# EAGLE schematic Main board schematic (EAGLE 9.2.0)

## Sheet 1 of 2
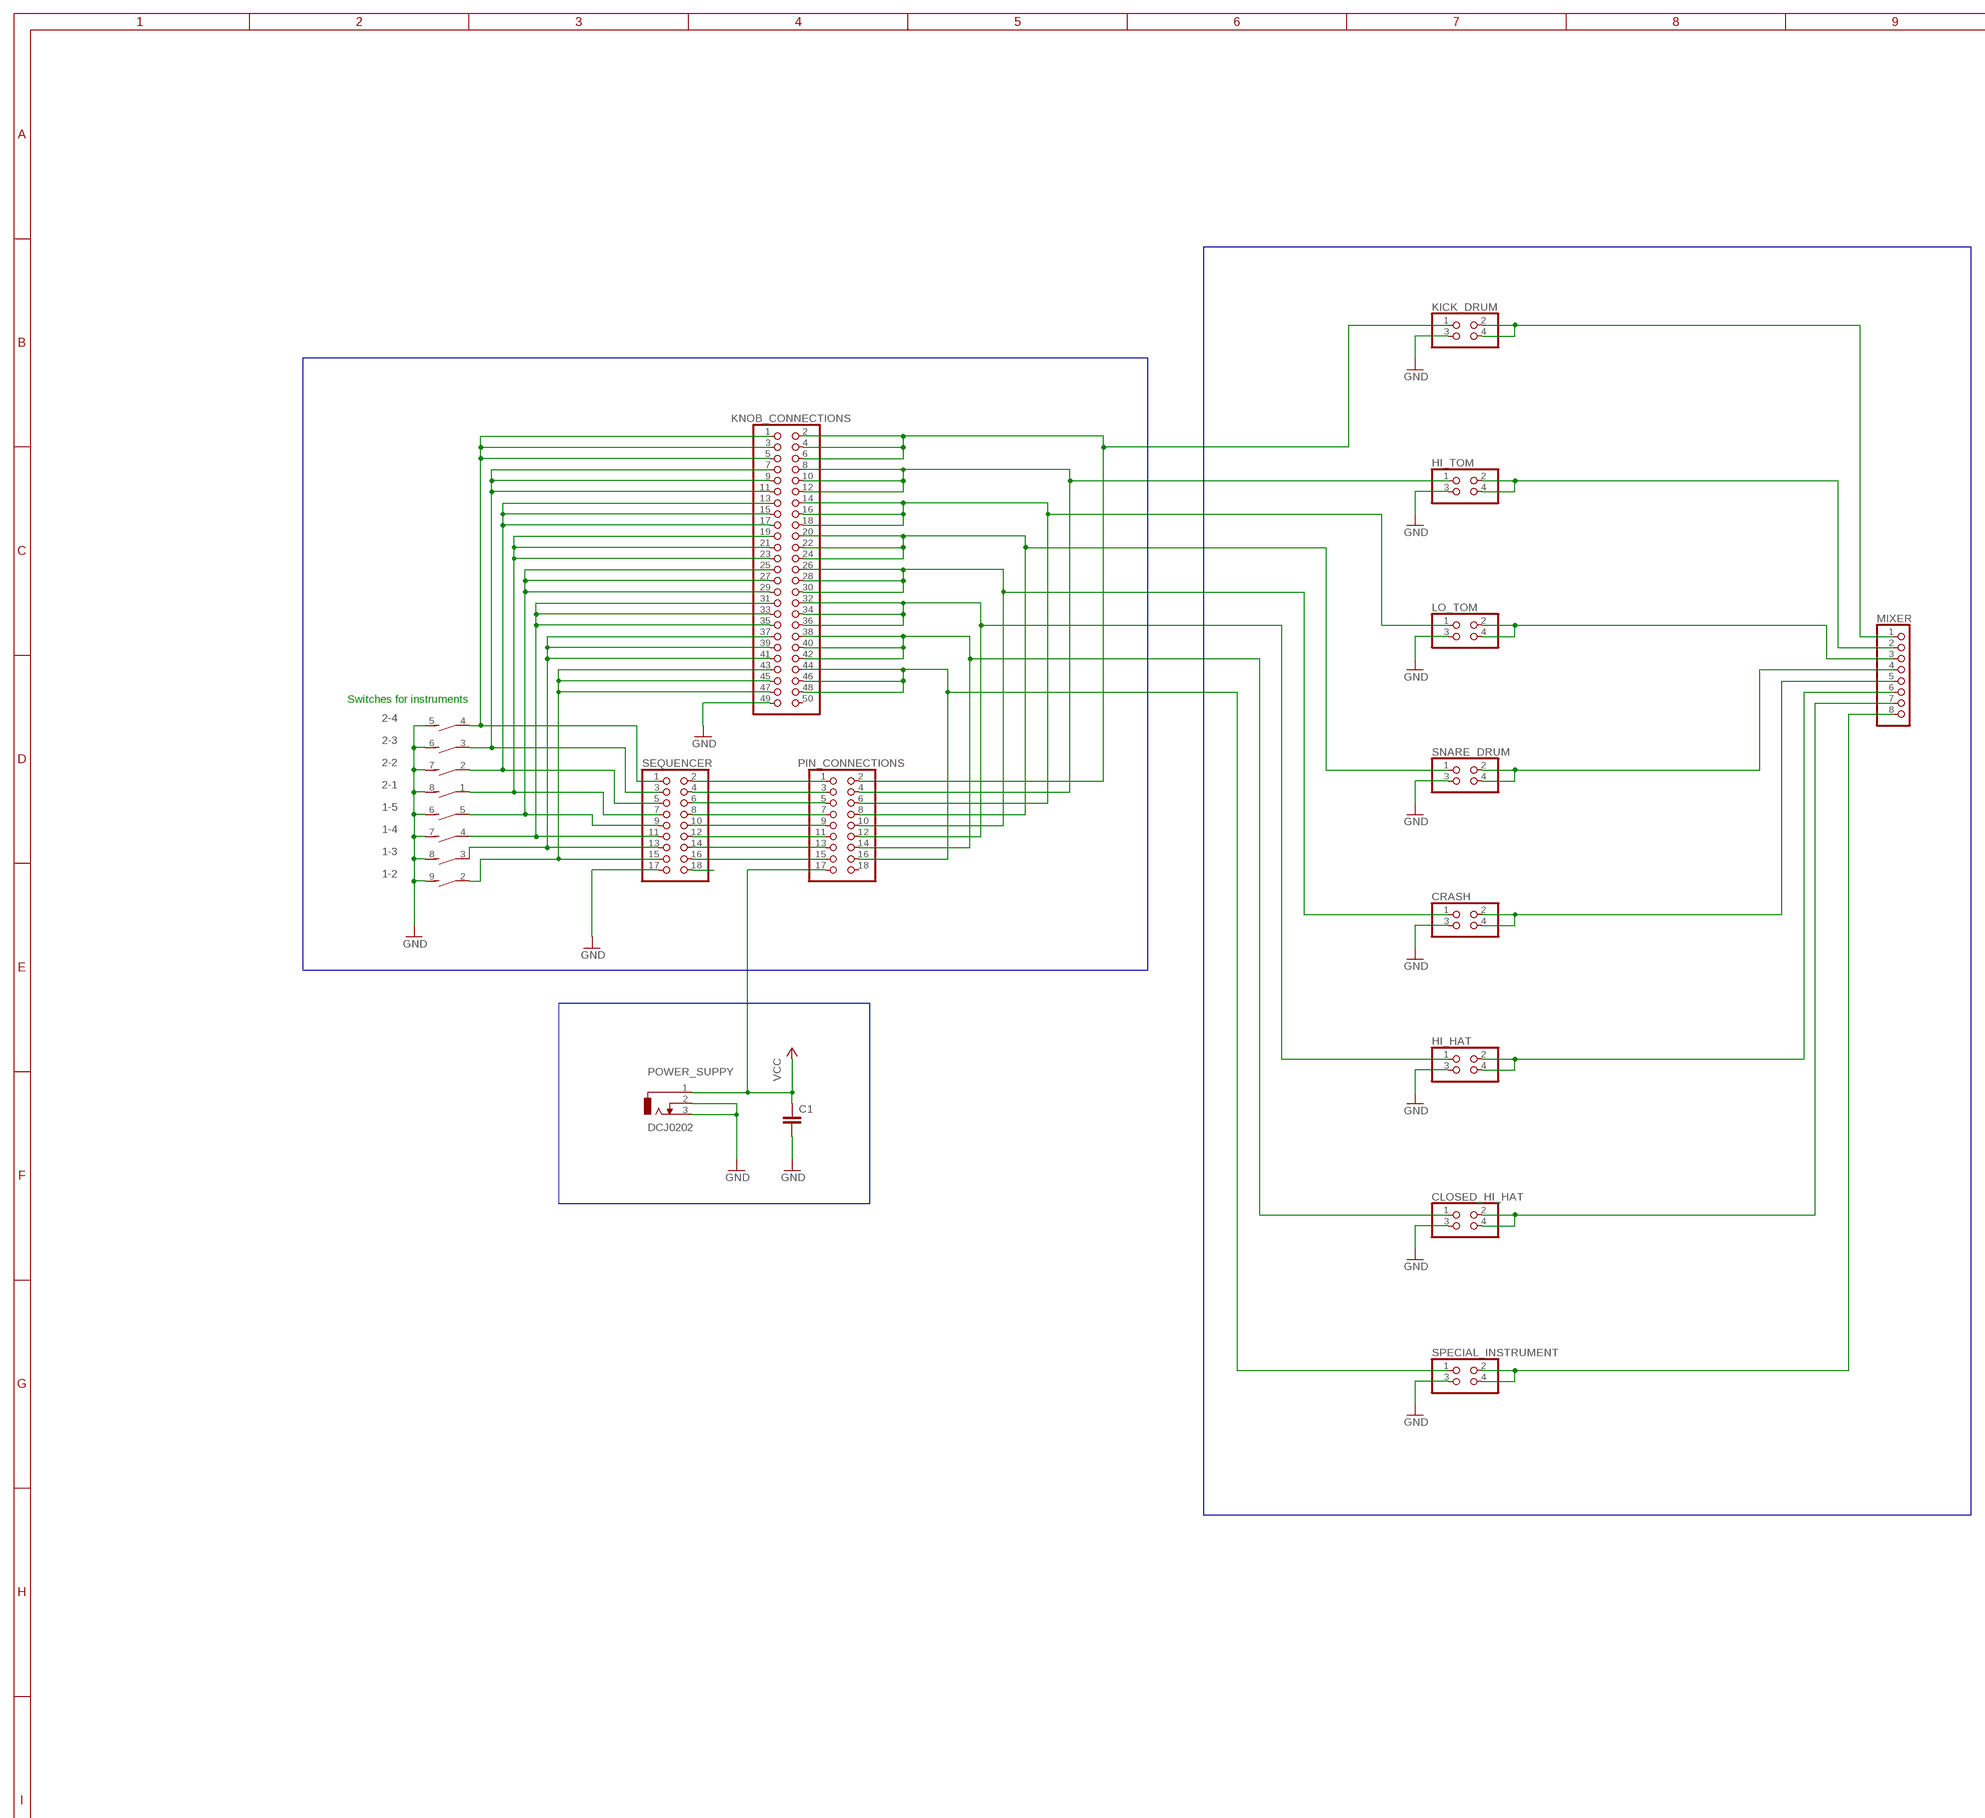
[diagram p0: schematic, sheet 1, part 1 of 2]
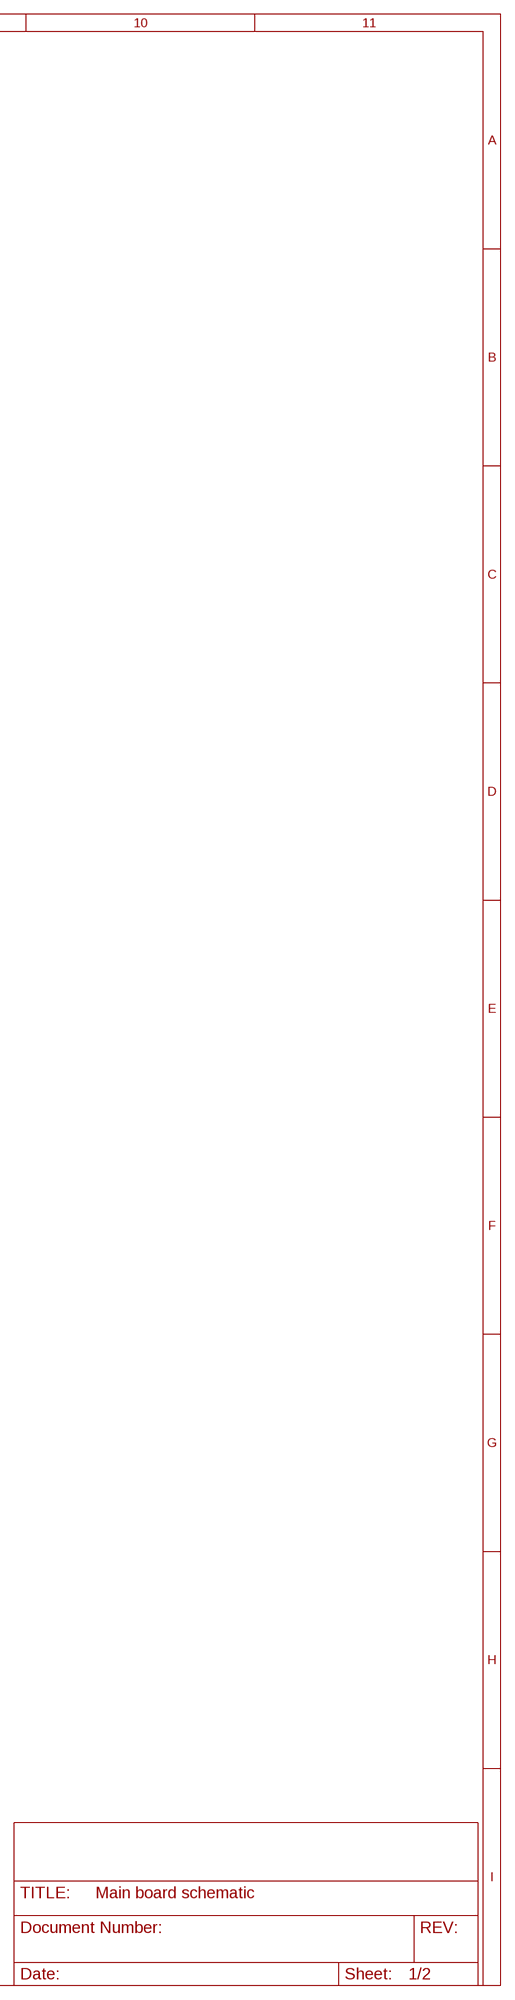
[diagram p1: schematic, sheet 1, part 2 of 2]

### Parts
1  DS05E  [DS-05]
2  DIP04S  [DIP04S]
C1  C2,5-3  [C2.5-3]
CLOSED_HI_HAT  PINHD-2X2  [2X02]
CRASH  PINHD-2X2  [2X02]
HI_HAT  PINHD-2X2  [2X02]
HI_TOM  PINHD-2X2  [2X02]
KICK_DRUM  PINHD-2X2  [2X02]
KNOB_CONNECTIONS  PINHD-2X25  [2X25]
LO_TOM  PINHD-2X2  [2X02]
MIXER  PINHD-1X8  [1X08]
PIN_CONNECTIONS  PINHD-2X9  [2X09]
POWER_SUPPY  DCJ0202  [DCJ0202]
SEQUENCER  PINHD-2X9  [2X09]
SNARE_DRUM  PINHD-2X2  [2X02]
SPECIAL_INSTRUMENT  PINHD-2X2  [2X02]

### Nets
GND: 1.6 1.7 1.8 1.9 2.5 2.6 2.7 2.8 C1.2 CLOSED_HI_HAT.3 CRASH.3 HI_HAT.3 HI_TOM.3 KICK_DRUM.3 KNOB_CONNECTIONS.49 LO_TOM.3 POWER_SUPPY.2 POWER_SUPPY.3 SEQUENCER.17 SNARE_DRUM.3 SPECIAL_INSTRUMENT.3 ; also sheet 2
N$1: 2.3 KNOB_CONNECTIONS.7 KNOB_CONNECTIONS.9 KNOB_CONNECTIONS.11 SEQUENCER.3
N$2: 2.1 KNOB_CONNECTIONS.19 KNOB_CONNECTIONS.21 KNOB_CONNECTIONS.23 SEQUENCER.7
N$3: 1.5 KNOB_CONNECTIONS.25 KNOB_CONNECTIONS.27 KNOB_CONNECTIONS.29 SEQUENCER.9
N$4: 1.4 KNOB_CONNECTIONS.31 KNOB_CONNECTIONS.33 KNOB_CONNECTIONS.35 SEQUENCER.11
N$5: 1.3 KNOB_CONNECTIONS.37 KNOB_CONNECTIONS.39 KNOB_CONNECTIONS.41 SEQUENCER.13
N$6: KNOB_CONNECTIONS.14 KNOB_CONNECTIONS.16 KNOB_CONNECTIONS.18 LO_TOM.1 PIN_CONNECTIONS.6
N$8: 2.4 KNOB_CONNECTIONS.1 KNOB_CONNECTIONS.3 KNOB_CONNECTIONS.5 SEQUENCER.1
N$9: PIN_CONNECTIONS.1 SEQUENCER.2
N$10: 1.2 KNOB_CONNECTIONS.43 KNOB_CONNECTIONS.45 KNOB_CONNECTIONS.47 SEQUENCER.15
N$11: PIN_CONNECTIONS.3 SEQUENCER.4
N$12: PIN_CONNECTIONS.5 SEQUENCER.6
N$13: KNOB_CONNECTIONS.20 KNOB_CONNECTIONS.22 KNOB_CONNECTIONS.24 PIN_CONNECTIONS.8 SNARE_DRUM.1
N$14: HI_TOM.1 KNOB_CONNECTIONS.8 KNOB_CONNECTIONS.10 KNOB_CONNECTIONS.12 PIN_CONNECTIONS.4
N$15: PIN_CONNECTIONS.7 SEQUENCER.8
N$16: PIN_CONNECTIONS.9 SEQUENCER.10
N$17: PIN_CONNECTIONS.11 SEQUENCER.12
N$18: PIN_CONNECTIONS.13 SEQUENCER.14
N$19: PIN_CONNECTIONS.15 SEQUENCER.16
N$22: 2.2 KNOB_CONNECTIONS.13 KNOB_CONNECTIONS.15 KNOB_CONNECTIONS.17 SEQUENCER.5
N$23: CRASH.1 KNOB_CONNECTIONS.26 KNOB_CONNECTIONS.28 KNOB_CONNECTIONS.30 PIN_CONNECTIONS.10
N$24: HI_HAT.1 KNOB_CONNECTIONS.32 KNOB_CONNECTIONS.34 KNOB_CONNECTIONS.36 PIN_CONNECTIONS.12
N$25: KICK_DRUM.1 KNOB_CONNECTIONS.2 KNOB_CONNECTIONS.4 KNOB_CONNECTIONS.6 PIN_CONNECTIONS.2
N$26: KICK_DRUM.2 KICK_DRUM.4 MIXER.1
N$27: HI_TOM.2 HI_TOM.4 MIXER.2
N$28: CLOSED_HI_HAT.1 KNOB_CONNECTIONS.38 KNOB_CONNECTIONS.40 KNOB_CONNECTIONS.42 PIN_CONNECTIONS.14
N$29: KNOB_CONNECTIONS.44 KNOB_CONNECTIONS.46 KNOB_CONNECTIONS.48 PIN_CONNECTIONS.16 SPECIAL_INSTRUMENT.1
N$30: LO_TOM.2 LO_TOM.4 MIXER.3
N$32: MIXER.4 SNARE_DRUM.2 SNARE_DRUM.4
N$33: CRASH.2 CRASH.4 MIXER.5
N$34: HI_HAT.2 HI_HAT.4 MIXER.6
N$35: CLOSED_HI_HAT.2 CLOSED_HI_HAT.4 MIXER.7
N$36: MIXER.8 SPECIAL_INSTRUMENT.2 SPECIAL_INSTRUMENT.4
VCC: C1.1 PIN_CONNECTIONS.17 POWER_SUPPY.1
X: SEQUENCER.18
Unconnected: 1.1 1.10 KNOB_CONNECTIONS.50 PIN_CONNECTIONS.18

### Buses
B$1
B$2
B$3

### Notes on the sheet
- Switches for instruments

## Sheet 2 of 2
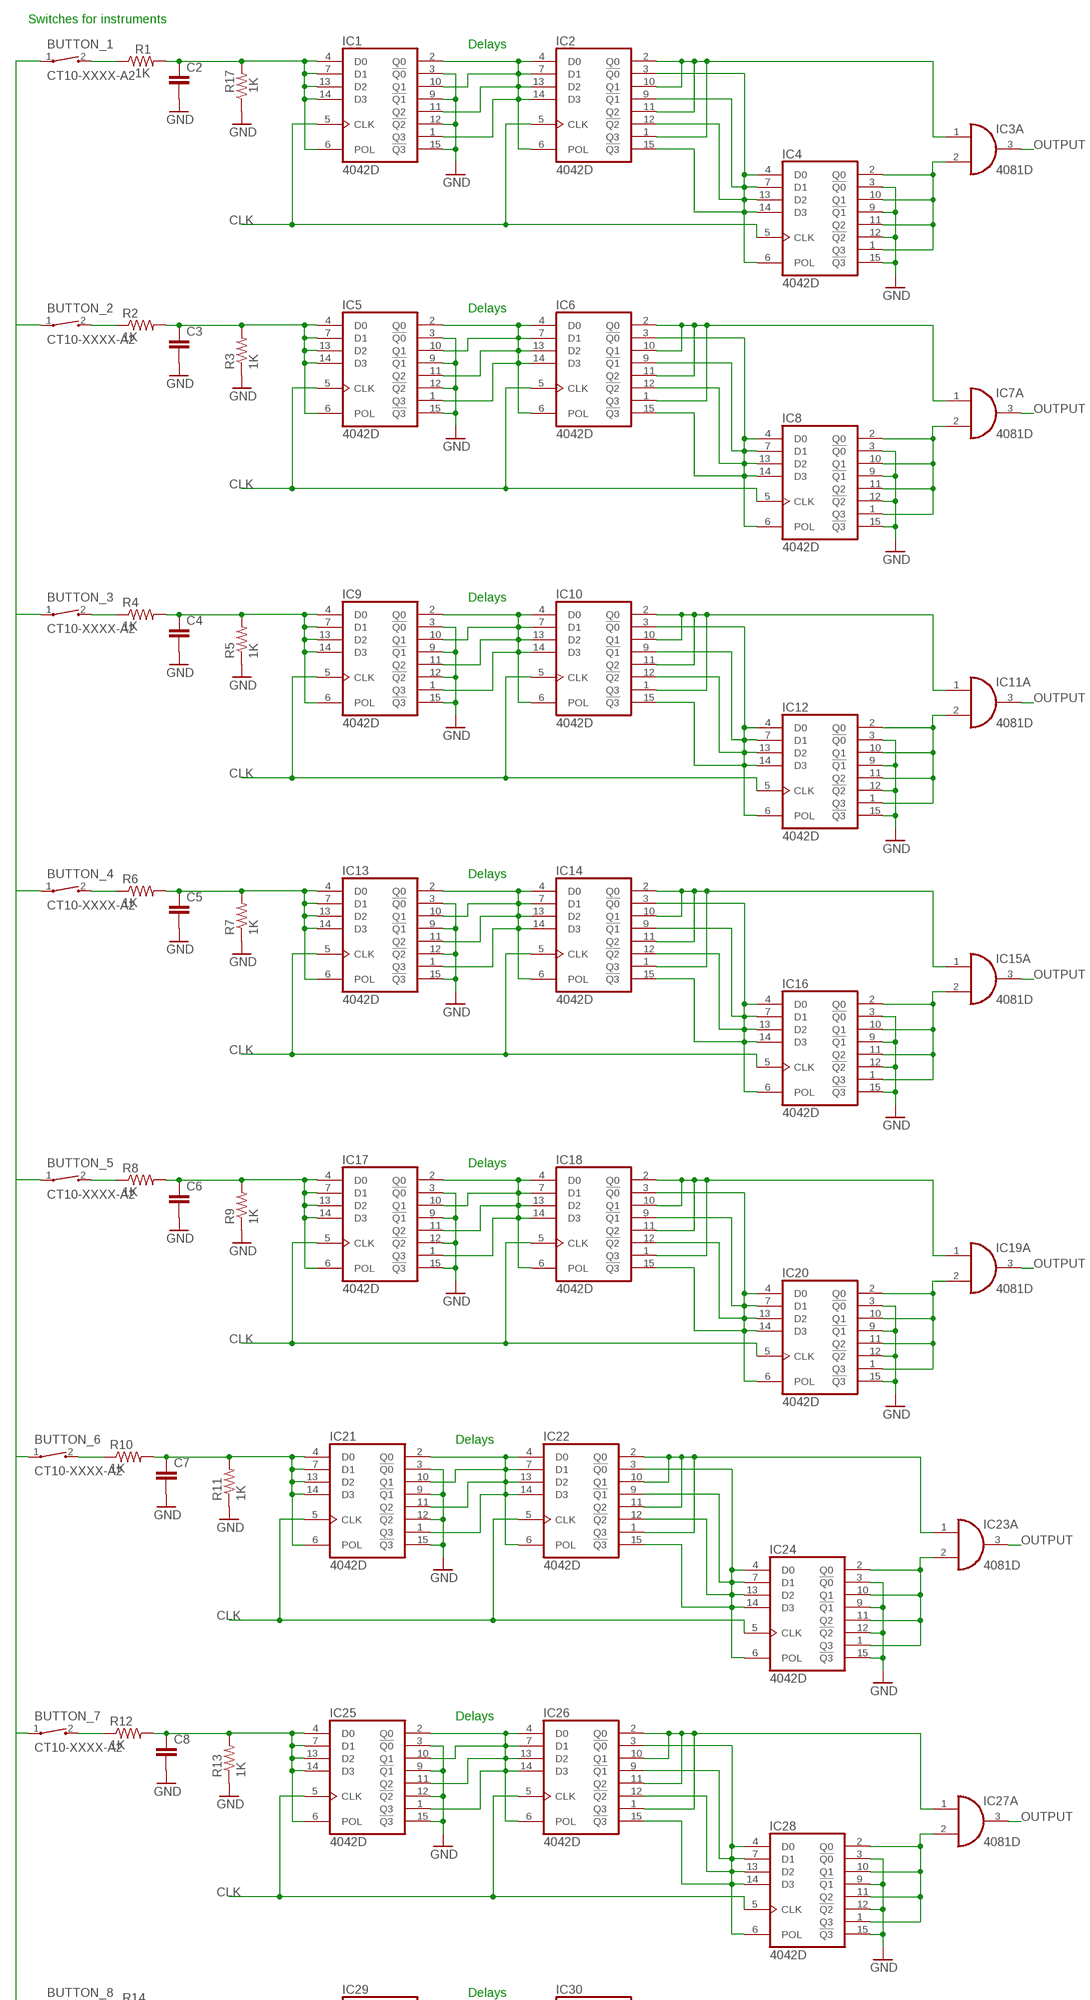
[diagram p2: schematic, sheet 2, part 1 of 3]
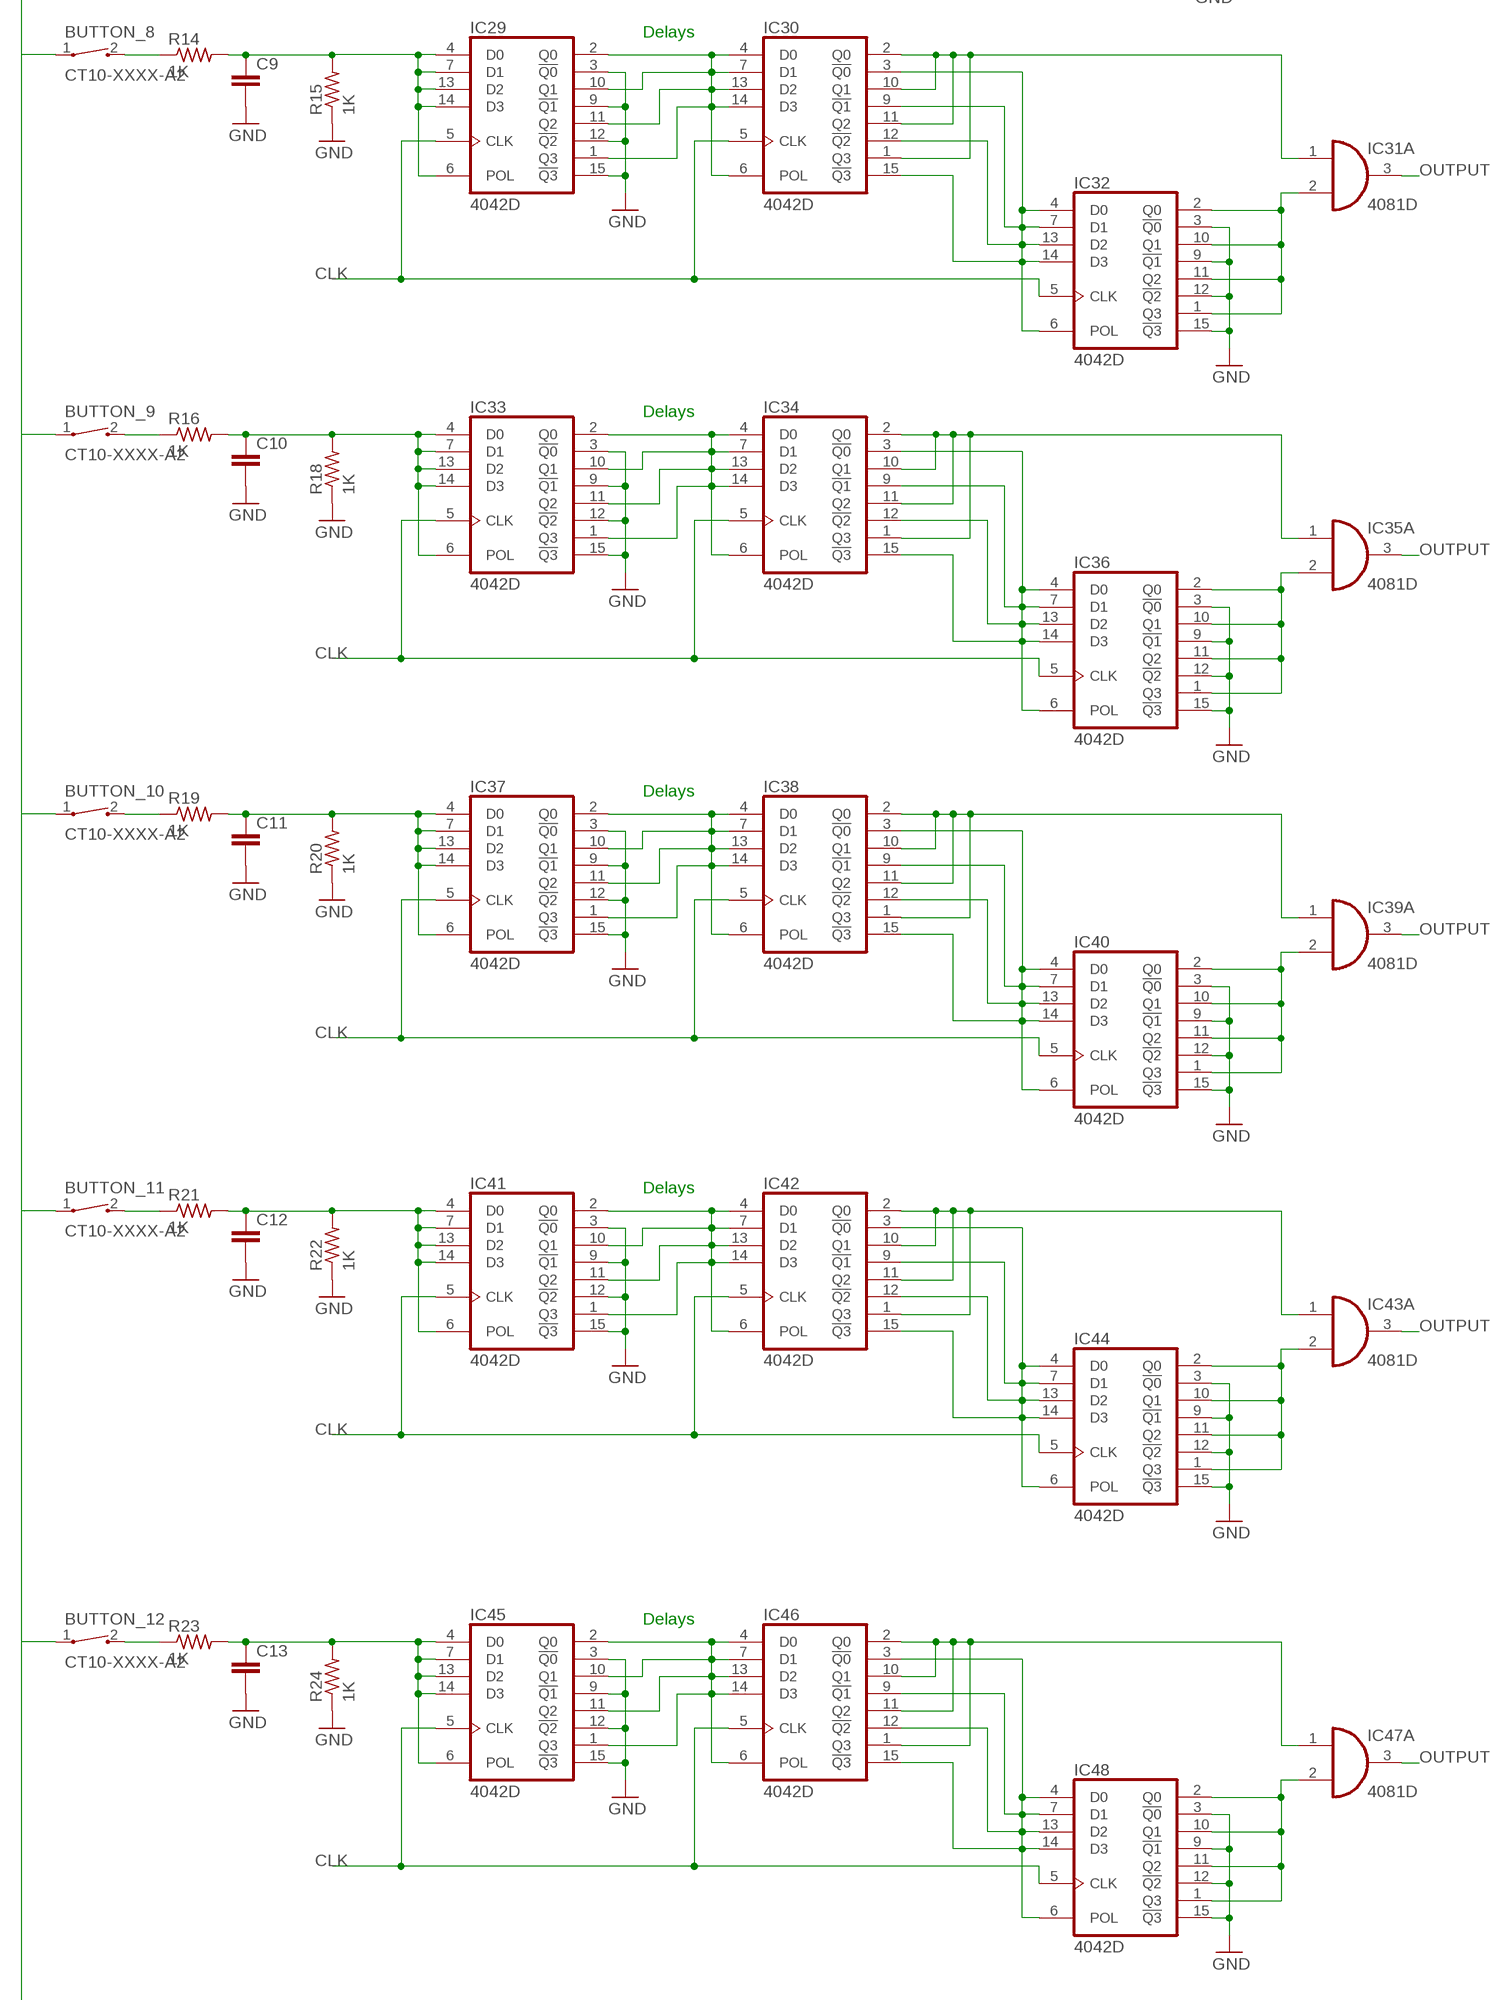
[diagram p3: schematic, sheet 2, part 2 of 3]
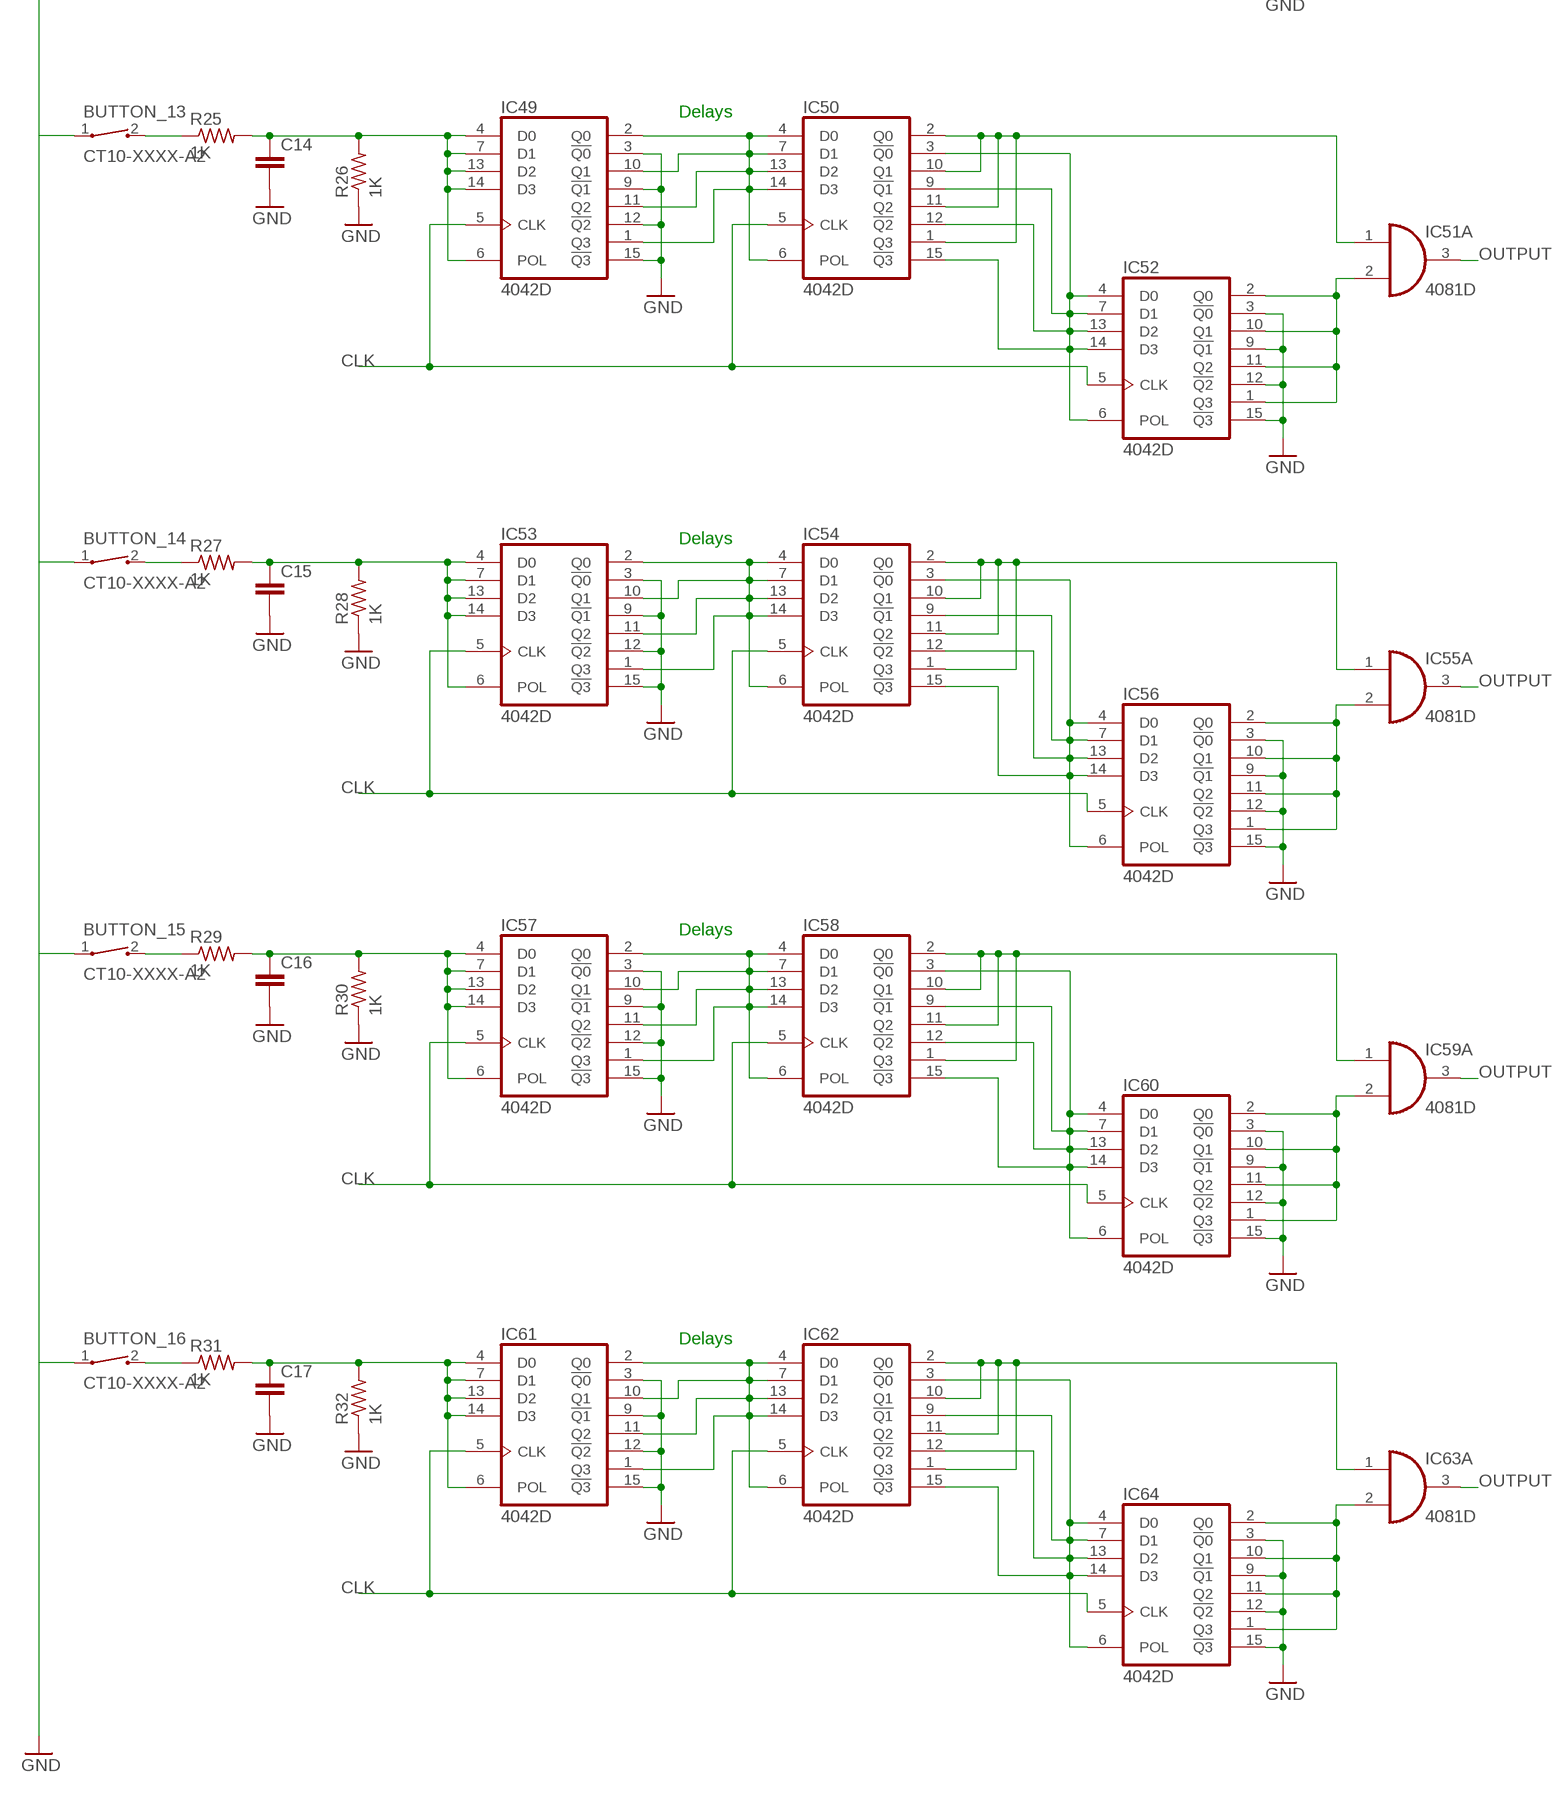
[diagram p4: schematic, sheet 2, part 3 of 3]

### Parts
BUTTON_1  CT10-XXXX-A2  [CT10-XXXX-A2]
BUTTON_2  CT10-XXXX-A2  [CT10-XXXX-A2]
BUTTON_3  CT10-XXXX-A2  [CT10-XXXX-A2]
BUTTON_4  CT10-XXXX-A2  [CT10-XXXX-A2]
BUTTON_5  CT10-XXXX-A2  [CT10-XXXX-A2]
BUTTON_6  CT10-XXXX-A2  [CT10-XXXX-A2]
BUTTON_7  CT10-XXXX-A2  [CT10-XXXX-A2]
BUTTON_8  CT10-XXXX-A2  [CT10-XXXX-A2]
BUTTON_9  CT10-XXXX-A2  [CT10-XXXX-A2]
BUTTON_10  CT10-XXXX-A2  [CT10-XXXX-A2]
BUTTON_11  CT10-XXXX-A2  [CT10-XXXX-A2]
BUTTON_12  CT10-XXXX-A2  [CT10-XXXX-A2]
BUTTON_13  CT10-XXXX-A2  [CT10-XXXX-A2]
BUTTON_14  CT10-XXXX-A2  [CT10-XXXX-A2]
BUTTON_15  CT10-XXXX-A2  [CT10-XXXX-A2]
BUTTON_16  CT10-XXXX-A2  [CT10-XXXX-A2]
C2  C5/3  [C5B3]
C3  C5/3  [C5B3]
C4  C5/3  [C5B3]
C5  C5/3  [C5B3]
C6  C5/3  [C5B3]
C7  C5/3  [C5B3]
C8  C5/3  [C5B3]
C9  C5/3  [C5B3]
C10  C5/3  [C5B3]
C11  C5/3  [C5B3]
C12  C5/3  [C5B3]
C13  C5/3  [C5B3]
C14  C5/3  [C5B3]
C15  C5/3  [C5B3]
C16  C5/3  [C5B3]
C17  C5/3  [C5B3]
IC1  4042D  [SO16]
IC2  4042D  [SO16]
IC3  4081D  [SO14]
IC4  4042D  [SO16]
IC5  4042D  [SO16]
IC6  4042D  [SO16]
IC7  4081D  [SO14]
IC8  4042D  [SO16]
IC9  4042D  [SO16]
IC10  4042D  [SO16]
IC11  4081D  [SO14]
IC12  4042D  [SO16]
IC13  4042D  [SO16]
IC14  4042D  [SO16]
IC15  4081D  [SO14]
IC16  4042D  [SO16]
IC17  4042D  [SO16]
IC18  4042D  [SO16]
IC19  4081D  [SO14]
IC20  4042D  [SO16]
IC21  4042D  [SO16]
IC22  4042D  [SO16]
IC23  4081D  [SO14]
IC24  4042D  [SO16]
IC25  4042D  [SO16]
IC26  4042D  [SO16]
IC27  4081D  [SO14]
IC28  4042D  [SO16]
IC29  4042D  [SO16]
IC30  4042D  [SO16]
IC31  4081D  [SO14]
IC32  4042D  [SO16]
IC33  4042D  [SO16]
IC34  4042D  [SO16]
IC35  4081D  [SO14]
IC36  4042D  [SO16]
IC37  4042D  [SO16]
IC38  4042D  [SO16]
IC39  4081D  [SO14]
IC40  4042D  [SO16]
IC41  4042D  [SO16]
IC42  4042D  [SO16]
IC43  4081D  [SO14]
IC44  4042D  [SO16]
IC45  4042D  [SO16]
IC46  4042D  [SO16]
IC47  4081D  [SO14]
IC48  4042D  [SO16]
IC49  4042D  [SO16]
IC50  4042D  [SO16]
IC51  4081D  [SO14]
IC52  4042D  [SO16]
IC53  4042D  [SO16]
IC54  4042D  [SO16]
IC55  4081D  [SO14]
IC56  4042D  [SO16]
IC57  4042D  [SO16]
IC58  4042D  [SO16]
IC59  4081D  [SO14]
IC60  4042D  [SO16]
IC61  4042D  [SO16]
IC62  4042D  [SO16]
IC63  4081D  [SO14]
IC64  4042D  [SO16]
R1  1K  R-US_0204/7  [0204/7]
R2  1K  R-US_0204/7  [0204/7]
R3  1K  R-US_0204/7  [0204/7]
R4  1K  R-US_0204/7  [0204/7]
R5  1K  R-US_0204/7  [0204/7]
R6  1K  R-US_0204/7  [0204/7]
R7  1K  R-US_0204/7  [0204/7]
R8  1K  R-US_0204/7  [0204/7]
R9  1K  R-US_0204/7  [0204/7]
R10  1K  R-US_0204/7  [0204/7]
R11  1K  R-US_0204/7  [0204/7]
R12  1K  R-US_0204/7  [0204/7]
R13  1K  R-US_0204/7  [0204/7]
R14  1K  R-US_0204/7  [0204/7]
R15  1K  R-US_0204/7  [0204/7]
R16  1K  R-US_0204/7  [0204/7]
R17  1K  R-US_0204/7  [0204/7]
R18  1K  R-US_0204/7  [0204/7]
R19  1K  R-US_0204/7  [0204/7]
R20  1K  R-US_0204/7  [0204/7]
R21  1K  R-US_0204/7  [0204/7]
R22  1K  R-US_0204/7  [0204/7]
R23  1K  R-US_0204/7  [0204/7]
R24  1K  R-US_0204/7  [0204/7]
R25  1K  R-US_0204/7  [0204/7]
R26  1K  R-US_0204/7  [0204/7]
R27  1K  R-US_0204/7  [0204/7]
R28  1K  R-US_0204/7  [0204/7]
R29  1K  R-US_0204/7  [0204/7]
R30  1K  R-US_0204/7  [0204/7]
R31  1K  R-US_0204/7  [0204/7]
R32  1K  R-US_0204/7  [0204/7]

### Nets
CLK: IC1.5(CLK) IC2.5(CLK) IC4.5(CLK) IC5.5(CLK) IC6.5(CLK) IC8.5(CLK) IC9.5(CLK) IC10.5(CLK) IC12.5(CLK) IC13.5(CLK) IC14.5(CLK) IC16.5(CLK) IC17.5(CLK) IC18.5(CLK) IC20.5(CLK) IC21.5(CLK) IC22.5(CLK) IC24.5(CLK) IC25.5(CLK) IC26.5(CLK) IC28.5(CLK) IC29.5(CLK) IC30.5(CLK) IC32.5(CLK) IC33.5(CLK) IC34.5(CLK) IC36.5(CLK) IC37.5(CLK) IC38.5(CLK) IC40.5(CLK) IC41.5(CLK) IC42.5(CLK) IC44.5(CLK) IC45.5(CLK) IC46.5(CLK) IC48.5(CLK) IC49.5(CLK) IC50.5(CLK) IC52.5(CLK) IC53.5(CLK) IC54.5(CLK) IC56.5(CLK) IC57.5(CLK) IC58.5(CLK) IC60.5(CLK) IC61.5(CLK) IC62.5(CLK) IC64.5(CLK)
GND: BUTTON_1.1 C2.2 C3.2 C4.2 C5.2 C6.2 C7.2 C8.2 C9.2 C10.2 C11.2 C12.2 C13.2 C14.2 C15.2 C16.2 C17.2 IC1.3(!Q0) IC1.9(!Q1) IC1.12(!Q2) IC1.15(!Q3) IC4.3(!Q0) IC4.9(!Q1) IC4.12(!Q2) IC4.15(!Q3) IC5.3(!Q0) IC5.9(!Q1) IC5.12(!Q2) IC5.15(!Q3) IC8.3(!Q0) IC8.9(!Q1) IC8.12(!Q2) IC8.15(!Q3) IC9.3(!Q0) IC9.9(!Q1) IC9.12(!Q2) IC9.15(!Q3) IC12.3(!Q0) IC12.9(!Q1) IC12.12(!Q2) IC12.15(!Q3) IC13.3(!Q0) IC13.9(!Q1) IC13.12(!Q2) IC13.15(!Q3) IC16.3(!Q0) IC16.9(!Q1) IC16.12(!Q2) IC16.15(!Q3) IC17.3(!Q0) IC17.9(!Q1) IC17.12(!Q2) IC17.15(!Q3) IC20.3(!Q0) IC20.9(!Q1) IC20.12(!Q2) IC20.15(!Q3) IC21.3(!Q0) IC21.9(!Q1) IC21.12(!Q2) IC21.15(!Q3) IC24.3(!Q0) IC24.9(!Q1) IC24.12(!Q2) IC24.15(!Q3) IC25.3(!Q0) IC25.9(!Q1) IC25.12(!Q2) IC25.15(!Q3) IC28.3(!Q0) IC28.9(!Q1) IC28.12(!Q2) IC28.15(!Q3) IC29.3(!Q0) IC29.9(!Q1) IC29.12(!Q2) IC29.15(!Q3) IC32.3(!Q0) IC32.9(!Q1) IC32.12(!Q2) IC32.15(!Q3) IC33.3(!Q0) IC33.9(!Q1) IC33.12(!Q2) IC33.15(!Q3) IC36.3(!Q0) IC36.9(!Q1) IC36.12(!Q2) IC36.15(!Q3) IC37.3(!Q0) IC37.9(!Q1) IC37.12(!Q2) IC37.15(!Q3) IC40.3(!Q0) IC40.9(!Q1) IC40.12(!Q2) IC40.15(!Q3) IC41.3(!Q0) IC41.9(!Q1) IC41.12(!Q2) IC41.15(!Q3) IC44.3(!Q0) IC44.9(!Q1) IC44.12(!Q2) IC44.15(!Q3) IC45.3(!Q0) IC45.9(!Q1) IC45.12(!Q2) IC45.15(!Q3) IC48.3(!Q0) IC48.9(!Q1) IC48.12(!Q2) IC48.15(!Q3) IC49.3(!Q0) IC49.9(!Q1) IC49.12(!Q2) IC49.15(!Q3) IC52.3(!Q0) IC52.9(!Q1) IC52.12(!Q2) IC52.15(!Q3) IC53.3(!Q0) IC53.9(!Q1) IC53.12(!Q2) IC53.15(!Q3) IC56.3(!Q0) IC56.9(!Q1) IC56.12(!Q2) IC56.15(!Q3) IC57.3(!Q0) IC57.9(!Q1) IC57.12(!Q2) IC57.15(!Q3) IC60.3(!Q0) IC60.9(!Q1) IC60.12(!Q2) IC60.15(!Q3) IC61.3(!Q0) IC61.9(!Q1) IC61.12(!Q2) IC61.15(!Q3) IC64.3(!Q0) IC64.9(!Q1) IC64.12(!Q2) IC64.15(!Q3) R3.1 R5.1 R7.1 R9.1 R11.1 R13.1 R15.1 R17.1 R18.1 R20.1 R22.1 R24.1 R26.1 R28.1 R30.1 R32.1 ; also sheet 1
N$7: BUTTON_1.2 R1.1
N$20: BUTTON_2.2 R2.1
N$21: C3.1 IC5.4(D0) IC5.6(POL) IC5.7(D1) IC5.13(D2) IC5.14(D3) R2.2 R3.2
N$31: IC5.1(Q3) IC5.2(Q0) IC5.10(Q1) IC5.11(Q2) IC6.4(D0) IC6.6(POL) IC6.7(D1) IC6.13(D2) IC6.14(D3)
N$37: IC7.2(A:I1) IC8.1(Q3) IC8.2(Q0) IC8.10(Q1) IC8.11(Q2)
N$38: IC6.3(!Q0) IC6.9(!Q1) IC6.12(!Q2) IC6.15(!Q3) IC8.4(D0) IC8.6(POL) IC8.7(D1) IC8.13(D2) IC8.14(D3)
N$39: IC6.1(Q3) IC6.2(Q0) IC6.10(Q1) IC6.11(Q2) IC7.1(A:I0)
N$40: BUTTON_2.1
N$41: BUTTON_3.2 R4.1
N$42: C4.1 IC9.4(D0) IC9.6(POL) IC9.7(D1) IC9.13(D2) IC9.14(D3) R4.2 R5.2
N$43: IC9.1(Q3) IC9.2(Q0) IC9.10(Q1) IC9.11(Q2) IC10.4(D0) IC10.6(POL) IC10.7(D1) IC10.13(D2) IC10.14(D3)
N$44: IC11.2(A:I1) IC12.1(Q3) IC12.2(Q0) IC12.10(Q1) IC12.11(Q2)
N$45: IC10.3(!Q0) IC10.9(!Q1) IC10.12(!Q2) IC10.15(!Q3) IC12.4(D0) IC12.6(POL) IC12.7(D1) IC12.13(D2) IC12.14(D3)
N$46: IC10.1(Q3) IC10.2(Q0) IC10.10(Q1) IC10.11(Q2) IC11.1(A:I0)
N$47: BUTTON_3.1
N$48: BUTTON_4.2 R6.1
N$49: C2.1 IC1.4(D0) IC1.6(POL) IC1.7(D1) IC1.13(D2) IC1.14(D3) R1.2 R17.2
N$50: C5.1 IC13.4(D0) IC13.6(POL) IC13.7(D1) IC13.13(D2) IC13.14(D3) R6.2 R7.2
N$51: IC13.1(Q3) IC13.2(Q0) IC13.10(Q1) IC13.11(Q2) IC14.4(D0) IC14.6(POL) IC14.7(D1) IC14.13(D2) IC14.14(D3)
N$52: IC15.2(A:I1) IC16.1(Q3) IC16.2(Q0) IC16.10(Q1) IC16.11(Q2)
N$53: IC14.3(!Q0) IC14.9(!Q1) IC14.12(!Q2) IC14.15(!Q3) IC16.4(D0) IC16.6(POL) IC16.7(D1) IC16.13(D2) IC16.14(D3)
N$54: IC14.1(Q3) IC14.2(Q0) IC14.10(Q1) IC14.11(Q2) IC15.1(A:I0)
N$55: BUTTON_4.1
N$56: BUTTON_5.2 R8.1
N$57: C6.1 IC17.4(D0) IC17.6(POL) IC17.7(D1) IC17.13(D2) IC17.14(D3) R8.2 R9.2
N$58: IC17.1(Q3) IC17.2(Q0) IC17.10(Q1) IC17.11(Q2) IC18.4(D0) IC18.6(POL) IC18.7(D1) IC18.13(D2) IC18.14(D3)
N$59: IC19.2(A:I1) IC20.1(Q3) IC20.2(Q0) IC20.10(Q1) IC20.11(Q2)
N$60: IC18.3(!Q0) IC18.9(!Q1) IC18.12(!Q2) IC18.15(!Q3) IC20.4(D0) IC20.6(POL) IC20.7(D1) IC20.13(D2) IC20.14(D3)
N$61: IC18.1(Q3) IC18.2(Q0) IC18.10(Q1) IC18.11(Q2) IC19.1(A:I0)
N$62: BUTTON_5.1
N$63: BUTTON_6.2 R10.1
N$64: C7.1 IC21.4(D0) IC21.6(POL) IC21.7(D1) IC21.13(D2) IC21.14(D3) R10.2 R11.2
N$65: IC1.1(Q3) IC1.2(Q0) IC1.10(Q1) IC1.11(Q2) IC2.4(D0) IC2.6(POL) IC2.7(D1) IC2.13(D2) IC2.14(D3)
N$66: IC21.1(Q3) IC21.2(Q0) IC21.10(Q1) IC21.11(Q2) IC22.4(D0) IC22.6(POL) IC22.7(D1) IC22.13(D2) IC22.14(D3)
N$68: IC23.2(A:I1) IC24.1(Q3) IC24.2(Q0) IC24.10(Q1) IC24.11(Q2)
N$69: IC3.2(A:I1) IC4.1(Q3) IC4.2(Q0) IC4.10(Q1) IC4.11(Q2)
N$70: IC2.3(!Q0) IC2.9(!Q1) IC2.12(!Q2) IC2.15(!Q3) IC4.4(D0) IC4.6(POL) IC4.7(D1) IC4.13(D2) IC4.14(D3)
N$71: IC22.3(!Q0) IC22.9(!Q1) IC22.12(!Q2) IC22.15(!Q3) IC24.4(D0) IC24.6(POL) IC24.7(D1) IC24.13(D2) IC24.14(D3)
N$72: IC22.1(Q3) IC22.2(Q0) IC22.10(Q1) IC22.11(Q2) IC23.1(A:I0)
N$73: BUTTON_6.1
N$74: BUTTON_7.2 R12.1
N$75: C8.1 IC25.4(D0) IC25.6(POL) IC25.7(D1) IC25.13(D2) IC25.14(D3) R12.2 R13.2
N$76: IC25.1(Q3) IC25.2(Q0) IC25.10(Q1) IC25.11(Q2) IC26.4(D0) IC26.6(POL) IC26.7(D1) IC26.13(D2) IC26.14(D3)
N$77: IC2.1(Q3) IC2.2(Q0) IC2.10(Q1) IC2.11(Q2) IC3.1(A:I0)
N$78: IC27.2(A:I1) IC28.1(Q3) IC28.2(Q0) IC28.10(Q1) IC28.11(Q2)
N$79: IC26.3(!Q0) IC26.9(!Q1) IC26.12(!Q2) IC26.15(!Q3) IC28.4(D0) IC28.6(POL) IC28.7(D1) IC28.13(D2) IC28.14(D3)
N$80: IC26.1(Q3) IC26.2(Q0) IC26.10(Q1) IC26.11(Q2) IC27.1(A:I0)
N$81: BUTTON_7.1
N$82: BUTTON_8.2 R14.1
N$83: C9.1 IC29.4(D0) IC29.6(POL) IC29.7(D1) IC29.13(D2) IC29.14(D3) R14.2 R15.2
N$84: IC29.1(Q3) IC29.2(Q0) IC29.10(Q1) IC29.11(Q2) IC30.4(D0) IC30.6(POL) IC30.7(D1) IC30.13(D2) IC30.14(D3)
N$85: IC31.2(A:I1) IC32.1(Q3) IC32.2(Q0) IC32.10(Q1) IC32.11(Q2)
N$86: IC30.3(!Q0) IC30.9(!Q1) IC30.12(!Q2) IC30.15(!Q3) IC32.4(D0) IC32.6(POL) IC32.7(D1) IC32.13(D2) IC32.14(D3)
N$87: IC30.1(Q3) IC30.2(Q0) IC30.10(Q1) IC30.11(Q2) IC31.1(A:I0)
N$88: BUTTON_8.1
N$89: BUTTON_9.2 R16.1
N$90: C10.1 IC33.4(D0) IC33.6(POL) IC33.7(D1) IC33.13(D2) IC33.14(D3) R16.2 R18.2
N$91: IC33.1(Q3) IC33.2(Q0) IC33.10(Q1) IC33.11(Q2) IC34.4(D0) IC34.6(POL) IC34.7(D1) IC34.13(D2) IC34.14(D3)
N$92: IC35.2(A:I1) IC36.1(Q3) IC36.2(Q0) IC36.10(Q1) IC36.11(Q2)
N$93: IC34.3(!Q0) IC34.9(!Q1) IC34.12(!Q2) IC34.15(!Q3) IC36.4(D0) IC36.6(POL) IC36.7(D1) IC36.13(D2) IC36.14(D3)
N$94: IC34.1(Q3) IC34.2(Q0) IC34.10(Q1) IC34.11(Q2) IC35.1(A:I0)
N$95: BUTTON_9.1
N$96: BUTTON_10.2 R19.1
N$97: C11.1 IC37.4(D0) IC37.6(POL) IC37.7(D1) IC37.13(D2) IC37.14(D3) R19.2 R20.2
N$98: IC37.1(Q3) IC37.2(Q0) IC37.10(Q1) IC37.11(Q2) IC38.4(D0) IC38.6(POL) IC38.7(D1) IC38.13(D2) IC38.14(D3)
N$99: IC39.2(A:I1) IC40.1(Q3) IC40.2(Q0) IC40.10(Q1) IC40.11(Q2)
N$100: IC38.3(!Q0) IC38.9(!Q1) IC38.12(!Q2) IC38.15(!Q3) IC40.4(D0) IC40.6(POL) IC40.7(D1) IC40.13(D2) IC40.14(D3)
N$101: IC38.1(Q3) IC38.2(Q0) IC38.10(Q1) IC38.11(Q2) IC39.1(A:I0)
N$102: BUTTON_10.1
N$103: BUTTON_11.2 R21.1
N$104: C12.1 IC41.4(D0) IC41.6(POL) IC41.7(D1) IC41.13(D2) IC41.14(D3) R21.2 R22.2
N$105: IC41.1(Q3) IC41.2(Q0) IC41.10(Q1) IC41.11(Q2) IC42.4(D0) IC42.6(POL) IC42.7(D1) IC42.13(D2) IC42.14(D3)
N$106: IC43.2(A:I1) IC44.1(Q3) IC44.2(Q0) IC44.10(Q1) IC44.11(Q2)
N$107: IC42.3(!Q0) IC42.9(!Q1) IC42.12(!Q2) IC42.15(!Q3) IC44.4(D0) IC44.6(POL) IC44.7(D1) IC44.13(D2) IC44.14(D3)
N$108: IC42.1(Q3) IC42.2(Q0) IC42.10(Q1) IC42.11(Q2) IC43.1(A:I0)
N$109: BUTTON_11.1
N$110: BUTTON_12.2 R23.1
N$111: C13.1 IC45.4(D0) IC45.6(POL) IC45.7(D1) IC45.13(D2) IC45.14(D3) R23.2 R24.2
N$112: IC45.1(Q3) IC45.2(Q0) IC45.10(Q1) IC45.11(Q2) IC46.4(D0) IC46.6(POL) IC46.7(D1) IC46.13(D2) IC46.14(D3)
N$113: IC47.2(A:I1) IC48.1(Q3) IC48.2(Q0) IC48.10(Q1) IC48.11(Q2)
N$114: IC46.3(!Q0) IC46.9(!Q1) IC46.12(!Q2) IC46.15(!Q3) IC48.4(D0) IC48.6(POL) IC48.7(D1) IC48.13(D2) IC48.14(D3)
N$115: IC46.1(Q3) IC46.2(Q0) IC46.10(Q1) IC46.11(Q2) IC47.1(A:I0)
N$116: BUTTON_12.1
N$117: BUTTON_13.2 R25.1
N$118: C14.1 IC49.4(D0) IC49.6(POL) IC49.7(D1) IC49.13(D2) IC49.14(D3) R25.2 R26.2
N$119: IC49.1(Q3) IC49.2(Q0) IC49.10(Q1) IC49.11(Q2) IC50.4(D0) IC50.6(POL) IC50.7(D1) IC50.13(D2) IC50.14(D3)
N$120: IC51.2(A:I1) IC52.1(Q3) IC52.2(Q0) IC52.10(Q1) IC52.11(Q2)
N$121: IC50.3(!Q0) IC50.9(!Q1) IC50.12(!Q2) IC50.15(!Q3) IC52.4(D0) IC52.6(POL) IC52.7(D1) IC52.13(D2) IC52.14(D3)
N$122: IC50.1(Q3) IC50.2(Q0) IC50.10(Q1) IC50.11(Q2) IC51.1(A:I0)
N$123: BUTTON_13.1
N$124: BUTTON_14.2 R27.1
N$125: C15.1 IC53.4(D0) IC53.6(POL) IC53.7(D1) IC53.13(D2) IC53.14(D3) R27.2 R28.2
N$126: IC53.1(Q3) IC53.2(Q0) IC53.10(Q1) IC53.11(Q2) IC54.4(D0) IC54.6(POL) IC54.7(D1) IC54.13(D2) IC54.14(D3)
N$127: IC55.2(A:I1) IC56.1(Q3) IC56.2(Q0) IC56.10(Q1) IC56.11(Q2)
N$128: IC54.3(!Q0) IC54.9(!Q1) IC54.12(!Q2) IC54.15(!Q3) IC56.4(D0) IC56.6(POL) IC56.7(D1) IC56.13(D2) IC56.14(D3)
N$129: IC54.1(Q3) IC54.2(Q0) IC54.10(Q1) IC54.11(Q2) IC55.1(A:I0)
N$130: BUTTON_14.1
N$131: BUTTON_15.2 R29.1
N$132: C16.1 IC57.4(D0) IC57.6(POL) IC57.7(D1) IC57.13(D2) IC57.14(D3) R29.2 R30.2
N$133: IC57.1(Q3) IC57.2(Q0) IC57.10(Q1) IC57.11(Q2) IC58.4(D0) IC58.6(POL) IC58.7(D1) IC58.13(D2) IC58.14(D3)
N$134: IC59.2(A:I1) IC60.1(Q3) IC60.2(Q0) IC60.10(Q1) IC60.11(Q2)
N$135: IC58.3(!Q0) IC58.9(!Q1) IC58.12(!Q2) IC58.15(!Q3) IC60.4(D0) IC60.6(POL) IC60.7(D1) IC60.13(D2) IC60.14(D3)
N$136: IC58.1(Q3) IC58.2(Q0) IC58.10(Q1) IC58.11(Q2) IC59.1(A:I0)
N$137: BUTTON_15.1
N$138: BUTTON_16.2 R31.1
N$139: C17.1 IC61.4(D0) IC61.6(POL) IC61.7(D1) IC61.13(D2) IC61.14(D3) R31.2 R32.2
N$140: IC61.1(Q3) IC61.2(Q0) IC61.10(Q1) IC61.11(Q2) IC62.4(D0) IC62.6(POL) IC62.7(D1) IC62.13(D2) IC62.14(D3)
N$141: IC63.2(A:I1) IC64.1(Q3) IC64.2(Q0) IC64.10(Q1) IC64.11(Q2)
N$142: IC62.3(!Q0) IC62.9(!Q1) IC62.12(!Q2) IC62.15(!Q3) IC64.4(D0) IC64.6(POL) IC64.7(D1) IC64.13(D2) IC64.14(D3)
N$143: IC62.1(Q3) IC62.2(Q0) IC62.10(Q1) IC62.11(Q2) IC63.1(A:I0)
N$144: BUTTON_16.1
OUTPUT: IC3.3(A:O) IC7.3(A:O) IC11.3(A:O) IC15.3(A:O) IC19.3(A:O) IC23.3(A:O) IC27.3(A:O) IC31.3(A:O) IC35.3(A:O) IC39.3(A:O) IC43.3(A:O) IC47.3(A:O) IC51.3(A:O) IC55.3(A:O) IC59.3(A:O) IC63.3(A:O)
Unconnected: IC3.4(B:O) IC3.5(B:I0) IC3.6(B:I1) IC3.8(C:I0) IC3.9(C:I1) IC3.10(C:O) IC3.11(D:O) IC3.12(D:I0) IC3.13(D:I1) IC7.4(B:O) IC7.5(B:I0) IC7.6(B:I1) IC7.8(C:I0) IC7.9(C:I1) IC7.10(C:O) IC7.11(D:O) IC7.12(D:I0) IC7.13(D:I1) IC11.4(B:O) IC11.5(B:I0) IC11.6(B:I1) IC11.8(C:I0) IC11.9(C:I1) IC11.10(C:O) IC11.11(D:O) IC11.12(D:I0) IC11.13(D:I1) IC15.4(B:O) IC15.5(B:I0) IC15.6(B:I1) IC15.8(C:I0) IC15.9(C:I1) IC15.10(C:O) IC15.11(D:O) IC15.12(D:I0) IC15.13(D:I1) IC19.4(B:O) IC19.5(B:I0) IC19.6(B:I1) IC19.8(C:I0) IC19.9(C:I1) IC19.10(C:O) IC19.11(D:O) IC19.12(D:I0) IC19.13(D:I1) IC23.4(B:O) IC23.5(B:I0) IC23.6(B:I1) IC23.8(C:I0) IC23.9(C:I1) IC23.10(C:O) IC23.11(D:O) IC23.12(D:I0) IC23.13(D:I1) IC27.4(B:O) IC27.5(B:I0) IC27.6(B:I1) IC27.8(C:I0) IC27.9(C:I1) IC27.10(C:O) IC27.11(D:O) IC27.12(D:I0) IC27.13(D:I1) IC31.4(B:O) IC31.5(B:I0) IC31.6(B:I1) IC31.8(C:I0) IC31.9(C:I1) IC31.10(C:O) IC31.11(D:O) IC31.12(D:I0) IC31.13(D:I1) IC35.4(B:O) IC35.5(B:I0) IC35.6(B:I1) IC35.8(C:I0) IC35.9(C:I1) IC35.10(C:O) IC35.11(D:O) IC35.12(D:I0) IC35.13(D:I1) IC39.4(B:O) IC39.5(B:I0) IC39.6(B:I1) IC39.8(C:I0) IC39.9(C:I1) IC39.10(C:O) IC39.11(D:O) IC39.12(D:I0) IC39.13(D:I1) IC43.4(B:O) IC43.5(B:I0) IC43.6(B:I1) IC43.8(C:I0) IC43.9(C:I1) IC43.10(C:O) IC43.11(D:O) IC43.12(D:I0) IC43.13(D:I1) IC47.4(B:O) IC47.5(B:I0) IC47.6(B:I1) IC47.8(C:I0) IC47.9(C:I1) IC47.10(C:O) IC47.11(D:O) IC47.12(D:I0) IC47.13(D:I1) IC51.4(B:O) IC51.5(B:I0) IC51.6(B:I1) IC51.8(C:I0) IC51.9(C:I1) IC51.10(C:O) IC51.11(D:O) IC51.12(D:I0) IC51.13(D:I1) IC55.4(B:O) IC55.5(B:I0) IC55.6(B:I1) IC55.8(C:I0) IC55.9(C:I1) IC55.10(C:O) IC55.11(D:O) IC55.12(D:I0) IC55.13(D:I1) IC59.4(B:O) IC59.5(B:I0) IC59.6(B:I1) IC59.8(C:I0) IC59.9(C:I1) IC59.10(C:O) IC59.11(D:O) IC59.12(D:I0) IC59.13(D:I1) IC63.4(B:O) IC63.5(B:I0) IC63.6(B:I1) IC63.8(C:I0) IC63.9(C:I1) IC63.10(C:O) IC63.11(D:O) IC63.12(D:I0) IC63.13(D:I1)

### Notes on the sheet
- Switches for instruments
- Delays
- Delays
- Delays
- Delays
- Delays
- Delays
- Delays
- Delays
- Delays
- Delays
- Delays
- Delays
- Delays
- Delays
- Delays
- Delays

## Power pins joined to a net without a drawn wire
VDD: IC1.16(VDD) IC2.16(VDD) IC3.14(P:VDD) IC4.16(VDD) IC5.16(VDD) IC6.16(VDD) IC7.14(P:VDD) IC8.16(VDD) IC9.16(VDD) IC10.16(VDD) IC11.14(P:VDD) IC12.16(VDD) IC13.16(VDD) IC14.16(VDD) IC15.14(P:VDD) IC16.16(VDD) IC17.16(VDD) IC18.16(VDD) IC19.14(P:VDD) IC20.16(VDD) IC21.16(VDD) IC22.16(VDD) IC23.14(P:VDD) IC24.16(VDD) IC25.16(VDD) IC26.16(VDD) IC27.14(P:VDD) IC28.16(VDD) IC29.16(VDD) IC30.16(VDD) IC31.14(P:VDD) IC32.16(VDD) IC33.16(VDD) IC34.16(VDD) IC35.14(P:VDD) IC36.16(VDD) IC37.16(VDD) IC38.16(VDD) IC39.14(P:VDD) IC40.16(VDD) IC41.16(VDD) IC42.16(VDD) IC43.14(P:VDD) IC44.16(VDD) IC45.16(VDD) IC46.16(VDD) IC47.14(P:VDD) IC48.16(VDD) IC49.16(VDD) IC50.16(VDD) IC51.14(P:VDD) IC52.16(VDD) IC53.16(VDD) IC54.16(VDD) IC55.14(P:VDD) IC56.16(VDD) IC57.16(VDD) IC58.16(VDD) IC59.14(P:VDD) IC60.16(VDD) IC61.16(VDD) IC62.16(VDD) IC63.14(P:VDD) IC64.16(VDD)
VSS: IC1.8(VSS) IC2.8(VSS) IC3.7(P:VSS) IC4.8(VSS) IC5.8(VSS) IC6.8(VSS) IC7.7(P:VSS) IC8.8(VSS) IC9.8(VSS) IC10.8(VSS) IC11.7(P:VSS) IC12.8(VSS) IC13.8(VSS) IC14.8(VSS) IC15.7(P:VSS) IC16.8(VSS) IC17.8(VSS) IC18.8(VSS) IC19.7(P:VSS) IC20.8(VSS) IC21.8(VSS) IC22.8(VSS) IC23.7(P:VSS) IC24.8(VSS) IC25.8(VSS) IC26.8(VSS) IC27.7(P:VSS) IC28.8(VSS) IC29.8(VSS) IC30.8(VSS) IC31.7(P:VSS) IC32.8(VSS) IC33.8(VSS) IC34.8(VSS) IC35.7(P:VSS) IC36.8(VSS) IC37.8(VSS) IC38.8(VSS) IC39.7(P:VSS) IC40.8(VSS) IC41.8(VSS) IC42.8(VSS) IC43.7(P:VSS) IC44.8(VSS) IC45.8(VSS) IC46.8(VSS) IC47.7(P:VSS) IC48.8(VSS) IC49.8(VSS) IC50.8(VSS) IC51.7(P:VSS) IC52.8(VSS) IC53.8(VSS) IC54.8(VSS) IC55.7(P:VSS) IC56.8(VSS) IC57.8(VSS) IC58.8(VSS) IC59.7(P:VSS) IC60.8(VSS) IC61.8(VSS) IC62.8(VSS) IC63.7(P:VSS) IC64.8(VSS)

## Library data of the parts
1 = switch-dil:DS05E: DIL/CODE SWITCH; OC_FARNELL: unknown; OC_NEWARK: unknown
2 = switch-dil:DIP04S: DIL/CODE SWITCH; OC_FARNELL: unknown; OC_NEWARK: unknown
BUTTON_1-BUTTON_16 = switch-coto:CT10-XXXX-: CT10 Series Molded Switch Source: www.cotorelay.com .. Coto_Technology__CT10-1530-G1.pdf
C1-C17 = capacitor-wima:C: CAPACITOR naming: grid - package width
CLOSED_HI_HAT CRASH HI_HAT HI_TOM KICK_DRUM LO_TOM SNARE_DRUM SPECIAL_INSTRUMENT = pinhead:PINHD-2X2: PIN HEADER
IC1 IC2 IC4-IC6 IC8-IC10 IC12-IC14 IC16-IC18 IC20-IC22 IC24-IC26 IC28-IC30 IC32-IC34 IC36-IC38 IC40-IC42 IC44-IC46 IC48-IC50 IC52-IC54 IC56-IC58 IC60-IC62 IC64 = 40xx:4042: Quad clocked D LATCH
IC3 IC7 IC11 IC15 IC19 IC23 IC27 IC31 IC35 IC39 IC43 IC47 IC51 IC55 IC59 IC63 = 40xx:4081: Quad 2-input AND
KNOB_CONNECTIONS = pinhead:PINHD-2X25: PIN HEADER
MIXER = pinhead:PINHD-1X8: PIN HEADER
PIN_CONNECTIONS SEQUENCER = pinhead:PINHD-2X9: PIN HEADER
POWER_SUPPY = con-jack:DCJ0202: DC POWER JACK Source: DCJ0202.pdf; OC_FARNELL: unknown; OC_NEWARK: unknown
R1-R32 = rcl:R-US_: RESISTOR, American symbol; SPICEPREFIX: R